# EAGLE schematic flightComputerD (EAGLE 7.1.0)
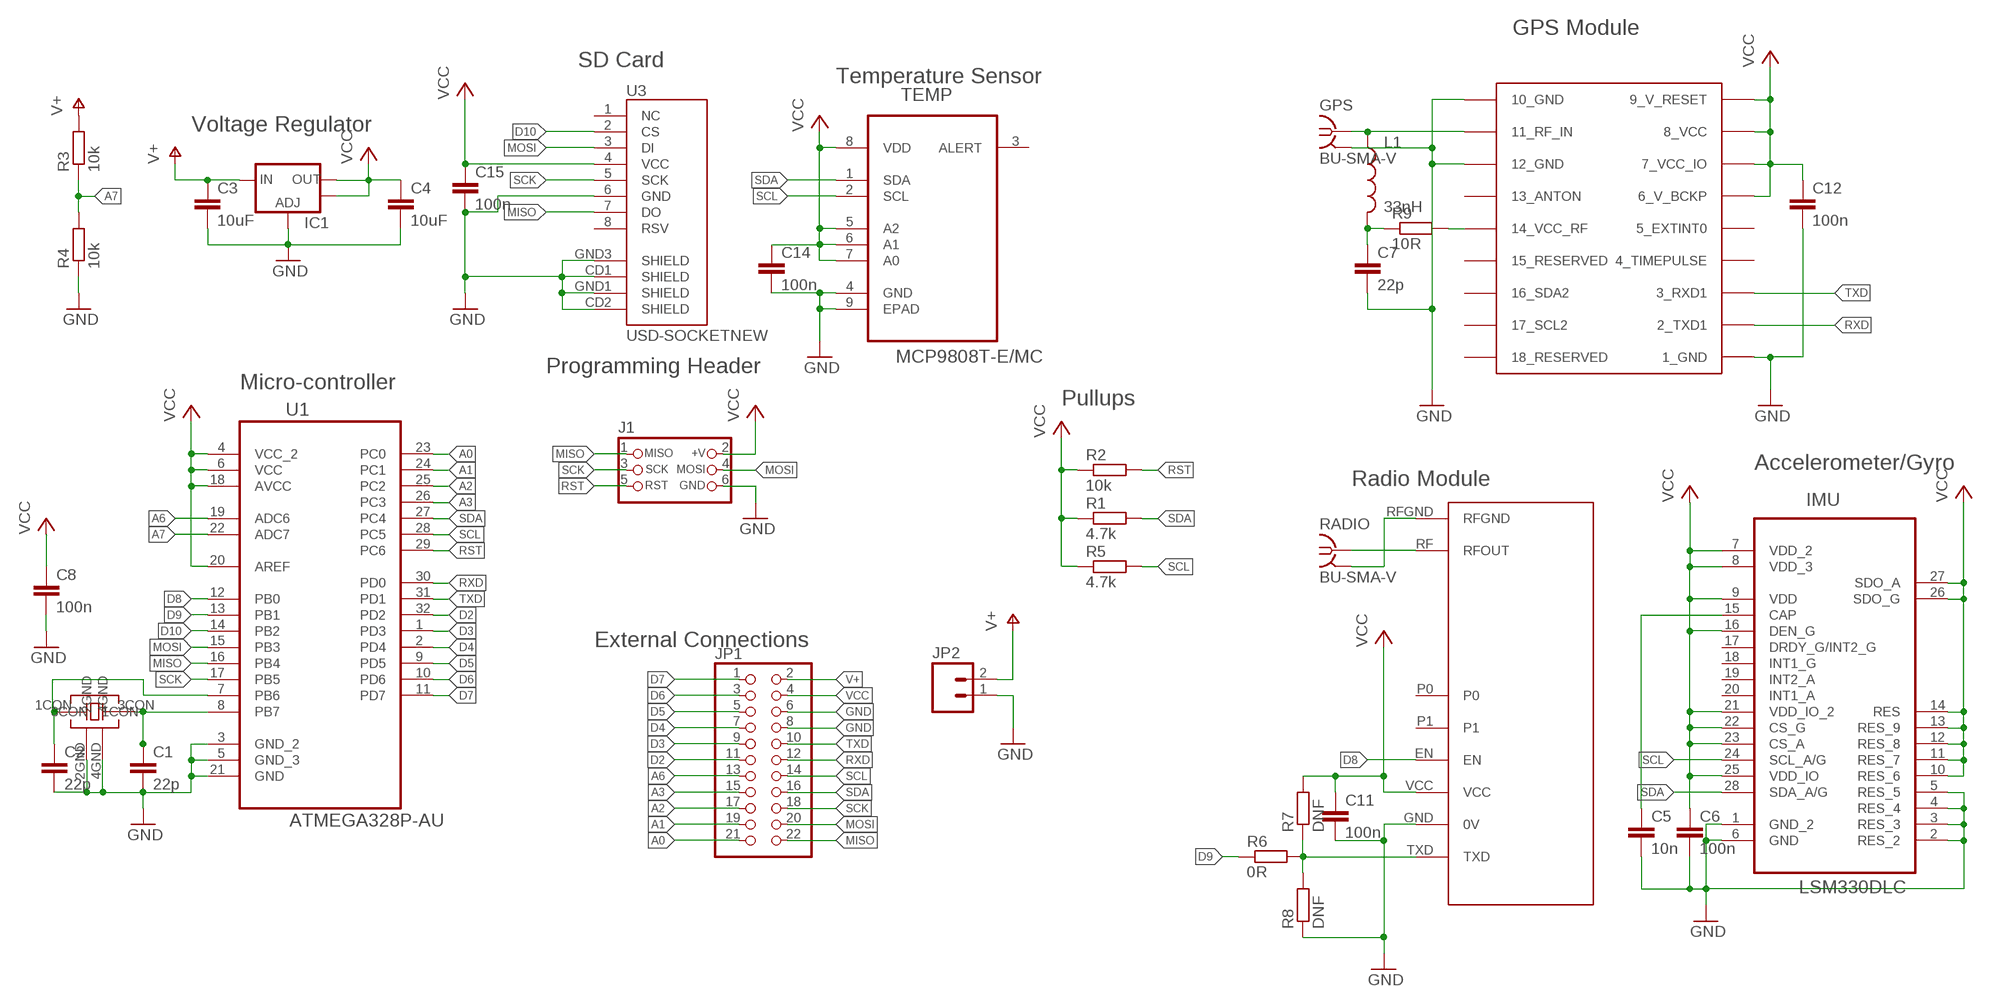
[diagram p0: schematic, sheet 1]

## Parts
C1  22p  C-EUC0603  [C0603]
C2  22p  C-EUC0603  [C0603]
C3  10uF  C-EUC0603  [C0603]
C4  10uF  C-EUC0603  [C0603]
C5  10n  C-EUC0603  [C0603]
C6  100n  C-EUC0603  [C0603]
C7  22p  C-EUC0603  [C0603]
C8  100n  C-EUC0603  [C0603]
C11  100n  C-EUC0603  [C0603]
C12  100n  C-EUC0603  [C0603]
C14  100n  C-EUC0603  [C0603]
C15  100n  C-EUC0603  [C0603]
GPS  BU-SMA-V  [BU-SMA-V]
IC1  V_REG_LM1117SOT223  [SOT223]
IMU  LSM330DLC  [LGA28R50P6X8_400X500X110]
J1  CON_HEADER_PRG_AVR_ICSP-PTH  [HEADER_PRG_2X03]
JP1  PINHD-2X11  [2X11]
JP2  M02PTH  [1X02]
L1  33nH  INDUCTOR0603  [0603]
R1  4.7k  R-EU_R0603  [R0603]
R2  10k  R-EU_R0603  [R0603]
R3  10k  R-EU_R0603  [R0603]
R4  10k  R-EU_R0603  [R0603]
R5  4.7k  R-EU_R0603  [R0603]
R6  0R  R-EU_R0603  [R0603]
R7  DNF  R-EU_R0603  [R0603]
R8  DNF  R-EU_R0603  [R0603]
R9  10R  R-EU_R0603  [R0603]
RADIO  BU-SMA-V  [BU-SMA-V]
TEMP  MCP9808T-E/MC  [DFN300X200X100-9N]
U1  ATMEGA328P-AU  [QFP80P900X900X120-32N]
U3  USD-SOCKETNEW  [MICRO-SD-SOCKET-PP]
U$1  CRYSTAL  [CRYSTAL]
U$4  UBLOX_MAX  [UBLOX_MAX]
U$6  RADIOMETRIX-MTX2  [RADIOMETRIX-MTX2]

## Nets
A0: JP1.21 U1.23(PC0)
A1: JP1.19 U1.24(PC1)
A2: JP1.17 U1.25(PC2)
A3: JP1.15 U1.26(PC3)
A6: JP1.13 U1.19(ADC6)
A7: R3.1 R4.2 U1.22(ADC7)
D2: JP1.11 U1.32(PD2)
D3: JP1.9 U1.1(PD3)
D4: JP1.7 U1.2(PD4)
D5: JP1.5 U1.9(PD5)
D6: JP1.3 U1.10(PD6)
D7: JP1.1 U1.11(PD7)
D8: U1.12(PB0) U$6.EN
D9: R6.1 U1.13(PB1)
D10: U1.14(PB2) U3.2(CS)
GND: C1.2 C2.2 C3.2 C4.2 C5.2 C6.2 C7.2 C8.2 C11.2 C12.2 C14.2 C15.2 GPS.2 GPS.3 GPS.4 GPS.5 IC1.1(ADJ) IMU.1(GND_2) IMU.2(RES_2) IMU.3(RES_3) IMU.4(RES_4) IMU.5(RES_5) IMU.6(GND) J1.6(GND) JP1.6 JP1.8 JP2.1 R4.1 R8.1 TEMP.4(GND) TEMP.9(EPAD) U1.3(GND_2) U1.5(GND_3) U1.21(GND) U3.6(GND) U3.CD1(SHIELD) U3.CD2(SHIELD) U3.GND1(SHIELD) U3.GND3(SHIELD) U$1.2GND U$1.4GND U$4.1_GND U$4.10_GND U$4.12_GND U$6.GND(0V)
MISO: J1.1(MISO) JP1.22 U1.16(PB4) U3.7(DO)
MOSI: J1.4(MOSI) JP1.20 U1.15(PB3) U3.3(DI)
N$1: GPS.1 L1.1 U$4.11_RF_IN
N$2: C1.1 U1.8(PB7) U$1.3CON
N$3: R9.2 U$4.14_VCC_RF
N$4: C2.1 U1.7(PB6) U$1.1CON
N$6: RADIO.1 U$6.RF(RFOUT)
N$7: R6.2 R7.1 R8.2 U$6.TXD
N$8: C7.1 L1.2 R9.1
N$12: C5.1 IMU.15(CAP)
RFGND: RADIO.2 RADIO.3 RADIO.4 RADIO.5 U$6.RFGND
RST: J1.5(RST) R2.2 U1.29(PC6)
RXD: JP1.12 U1.30(PD0) U$4.2_TXD1
SCK: J1.3(SCK) JP1.18 U1.17(PB5) U3.5(SCK)
SCL: IMU.24(SCL_A/G) JP1.14 R5.2 TEMP.2(SCL) U1.28(PC5)
SDA: IMU.28(SDA_A/G) JP1.16 R1.2 TEMP.1(SDA) U1.27(PC4)
TXD: JP1.10 U1.31(PD1) U$4.3_RXD1
V+: C3.1 IC1.3(IN) JP1.2 JP2.2 R3.2
VCC: C4.1 C6.1 C8.1 C11.1 C12.1 C14.1 C15.1 IC1.2(OUT) IC1.4(OUT) IMU.7(VDD_2) IMU.8(VDD_3) IMU.9(VDD) IMU.10(RES_6) IMU.11(RES_7) IMU.12(RES_8) IMU.13(RES_9) IMU.14(RES) IMU.16(DEN_G) IMU.21(VDD_IO_2) IMU.22(CS_G) IMU.23(CS_A) IMU.25(VDD_IO) IMU.26(SDO_G) IMU.27(SDO_A) J1.2(+V) JP1.4 R1.1 R2.1 R5.1 R7.2 TEMP.5(A2) TEMP.6(A1) TEMP.7(A0) TEMP.8(VDD) U1.4(VCC_2) U1.6(VCC) U1.18(AVCC) U1.20(AREF) U3.4(VCC) U$4.6_V_BCKP U$4.7_VCC_IO U$4.8_VCC U$4.9_V_RESET U$6.VCC
Unconnected: IMU.17(DRDY_G/INT2_G) IMU.18(INT1_G) IMU.19(INT2_A) IMU.20(INT1_A) TEMP.3(ALERT) U3.1(NC) U3.8(RSV) U$4.4_TIMEPULSE U$4.5_EXTINT0 U$4.13_ANTON U$4.15_RESERVED U$4.16_SDA2 U$4.17_SCL2 U$4.18_RESERVED U$6.P0 U$6.P1

## Notes on the sheet
- GPS Module
- SD Card
- Temperature Sensor
- Voltage Regulator
- Programming Header
- Micro-controller
- Pullups
- Accelerometer/Gyro
- Radio Module
- External Connections

## Library data of the parts
C1 C2 C7 = rcl:C-EU: CAPACITOR, European symbol; OC_FARNELL: 2309012
C3 C4 = rcl:C-EU: CAPACITOR, European symbol; OC_FARNELL: 2426958
C5 = rcl:C-EU: CAPACITOR, European symbol; OC_FARNELL: 2066471
C6 C8 C11 C12 C14 C15 = rcl:C-EU: CAPACITOR, European symbol; OC_FARNELL: 2429362
GPS RADIO = con-coax:BU-SMA-V: FEMALE SMA CONNECTOR Radiall distributor RS 112-3794; OC_FARNELL: 2144531; OC_NEWARK: unknown
IC1 = SparkFun:V_REG_LM1117: Voltage Regulator LM1117 Standard adjustable voltage regulator but in SMD form. Spark Fun Electronics SKU : COM-00595; OC_FARNELL: 1651283
IMU = mattsLib:LSM330DLC: ACC/GYRO, 3D, 16G, 2000DPS, 28LGA; MPN: LSM330DLC; OC_FARNELL: 2295820; OC_NEWARK: 68W6732; PACKAGE: LGA-28L; SUPPLIER: STMicroelectronics
J1 = dp_devices:CON_HEADER_PRG_AVR_ICSP: 2x3 AVR ICSP programming header; OC_FARNELL: 2311147
JP1 = pinhead:PINHD-2X11: PIN HEADER
JP2 = SparkFun:M02: Header 2 Standard 2-pin 0.1" header. Use with straight break away headers (SKU : PRT-00116), right angle break away headers (PRT-00553), swiss pins (PRT-00743), machine pins (PRT-00117), and female headers (PRT-00115). Molex polarized connector foot print use with SKU : PRT-08233 with associated crimp pins and housings.
L1 = SparkFun:INDUCTOR: Inductors Basic Inductor/Choke - 0603 and 1206. Footprints are not proven and vary greatly between part numbers.; OC_FARNELL: 2285904
R1 R5 R7 R8 = rcl:R-EU_: RESISTOR, European symbol; OC_FARNELL: 1799457
R2-R4 = rcl:R-EU_: RESISTOR, European symbol; OC_FARNELL: 1652827
R6 = rcl:R-EU_: RESISTOR, European symbol; OC_FARNELL: 2309106
R9 = rcl:R-EU_: RESISTOR, European symbol; OC_FARNELL: 2321756
TEMP = mattsLib:MCP9808T-E/MC: TEMP SENSOR, I2C, -20 TO 100 DEG, 8DFN; MPN: MCP9808T-E/MC; OC_FARNELL: 2080524; OC_NEWARK: 73T0714; PACKAGE: 8DFN; SUPPLIER: Microchip
U1 = Atmel_By_element14_Batch_1-00:ATMEGA328P-AU: 8-bit Microcontroller with In-System Programmable Flash; MPN: ATMEGA328P-AU; OC_FARNELL: 1715486; OC_NEWARK: 14R4631; PACKAGE: TQFP-32; SUPPLIER: Atmel
U3 = SparkFun:USD-SOCKET: microSD Socket Push-push type uSD socket. Schematic element and footprint production proven. Spark Fun Electronics SKU : PRT-00127. tDoc lines correctly indicate media card edge positions when inserting (unlocked, locked, depressed).; OC_FARNELL: 2443092
U$1 = mattsLib:CRYSTAL; OC_FARNELL: 1842060
U$4 = Ava:UBLOX_MAX: UBLOX MAX
U$6 = Ava:RADIOMETRIX-MTX2